# EAGLE design model (EAGLE 9.6.2)
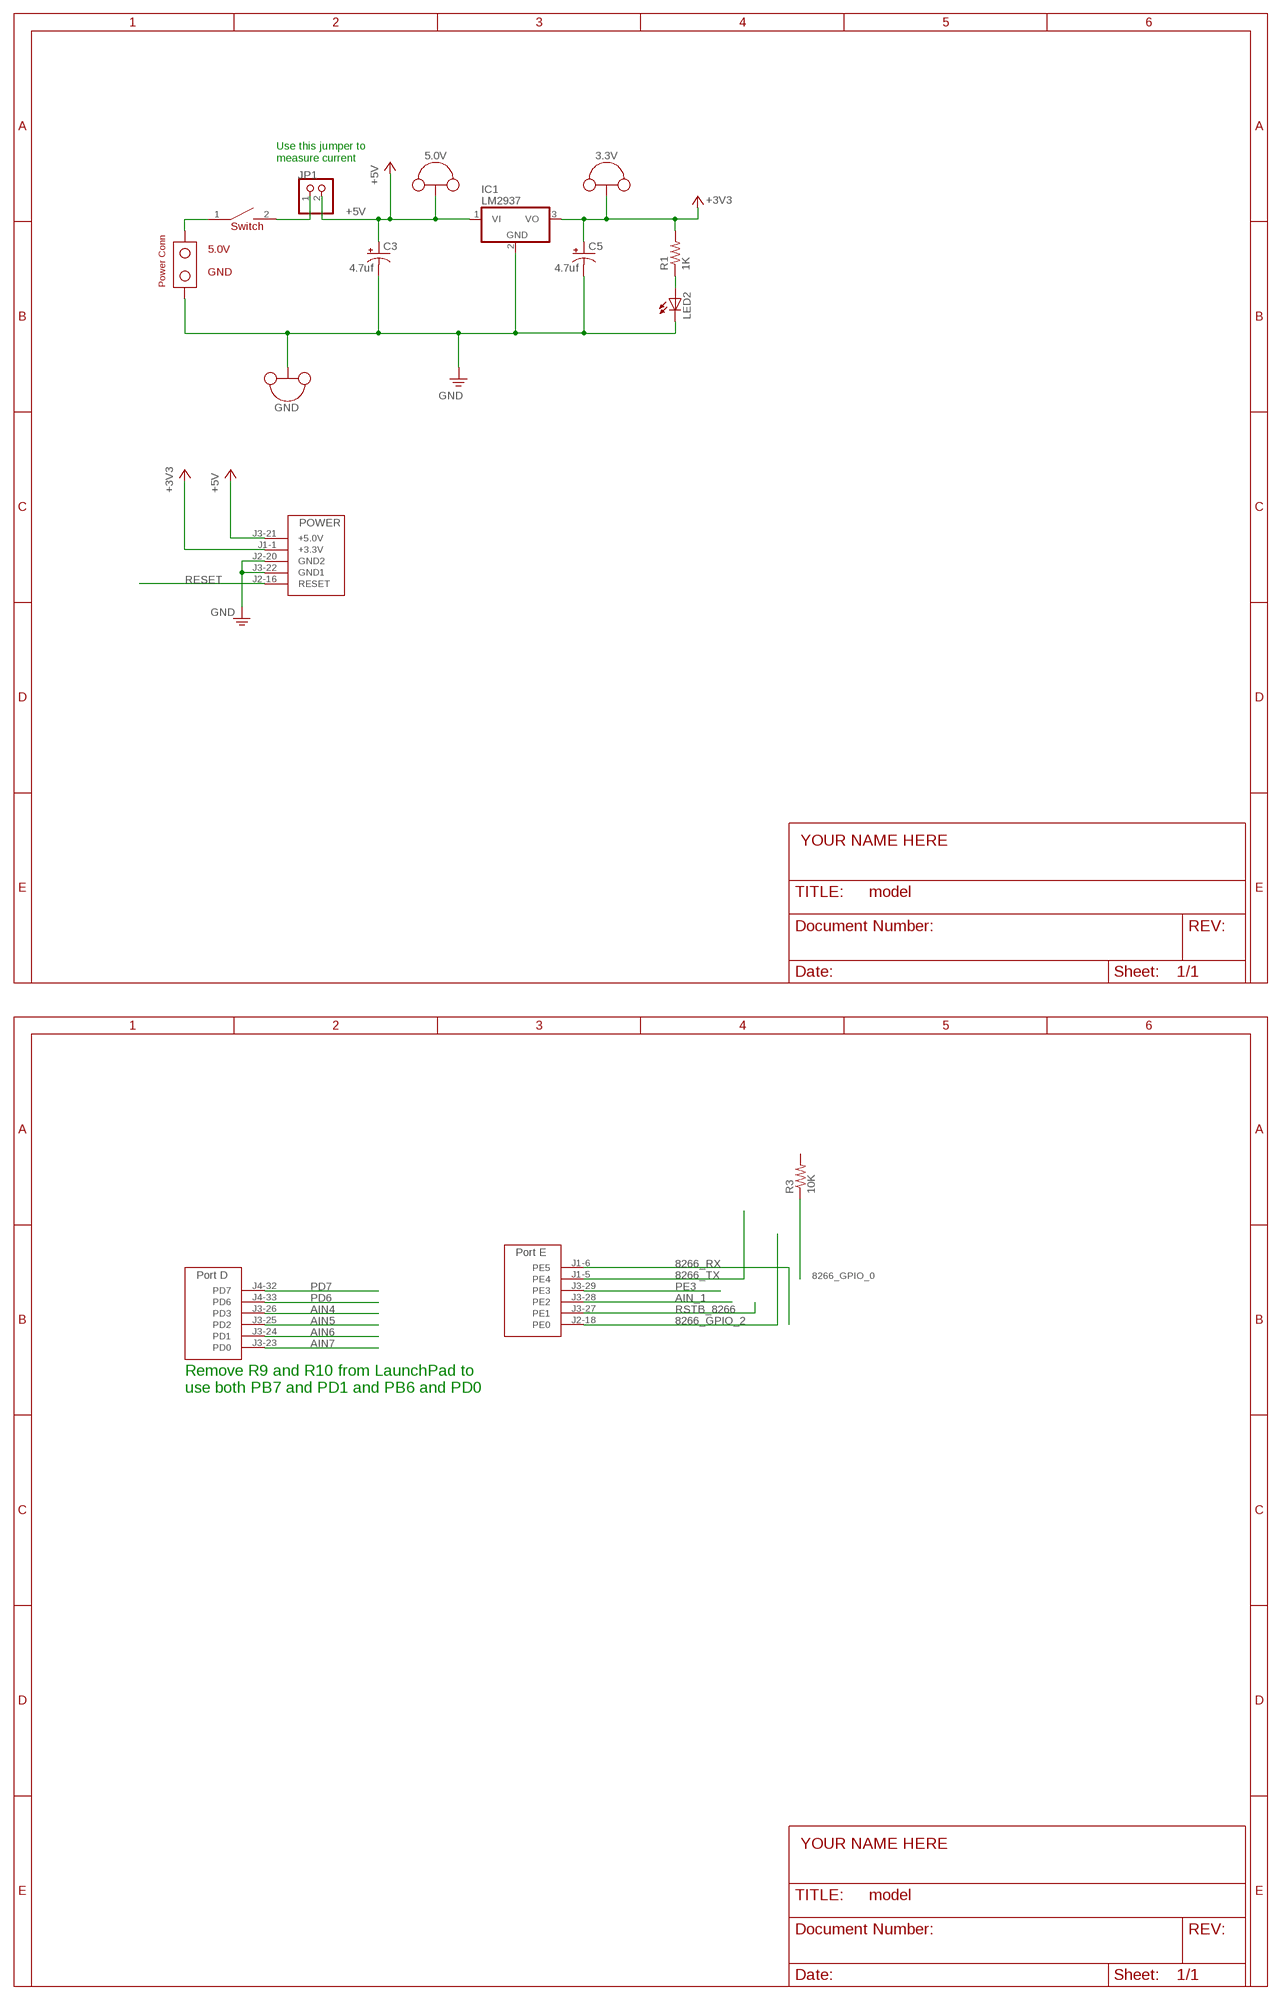
[diagram p0: schematic, sheet 1, part 1 of 2]
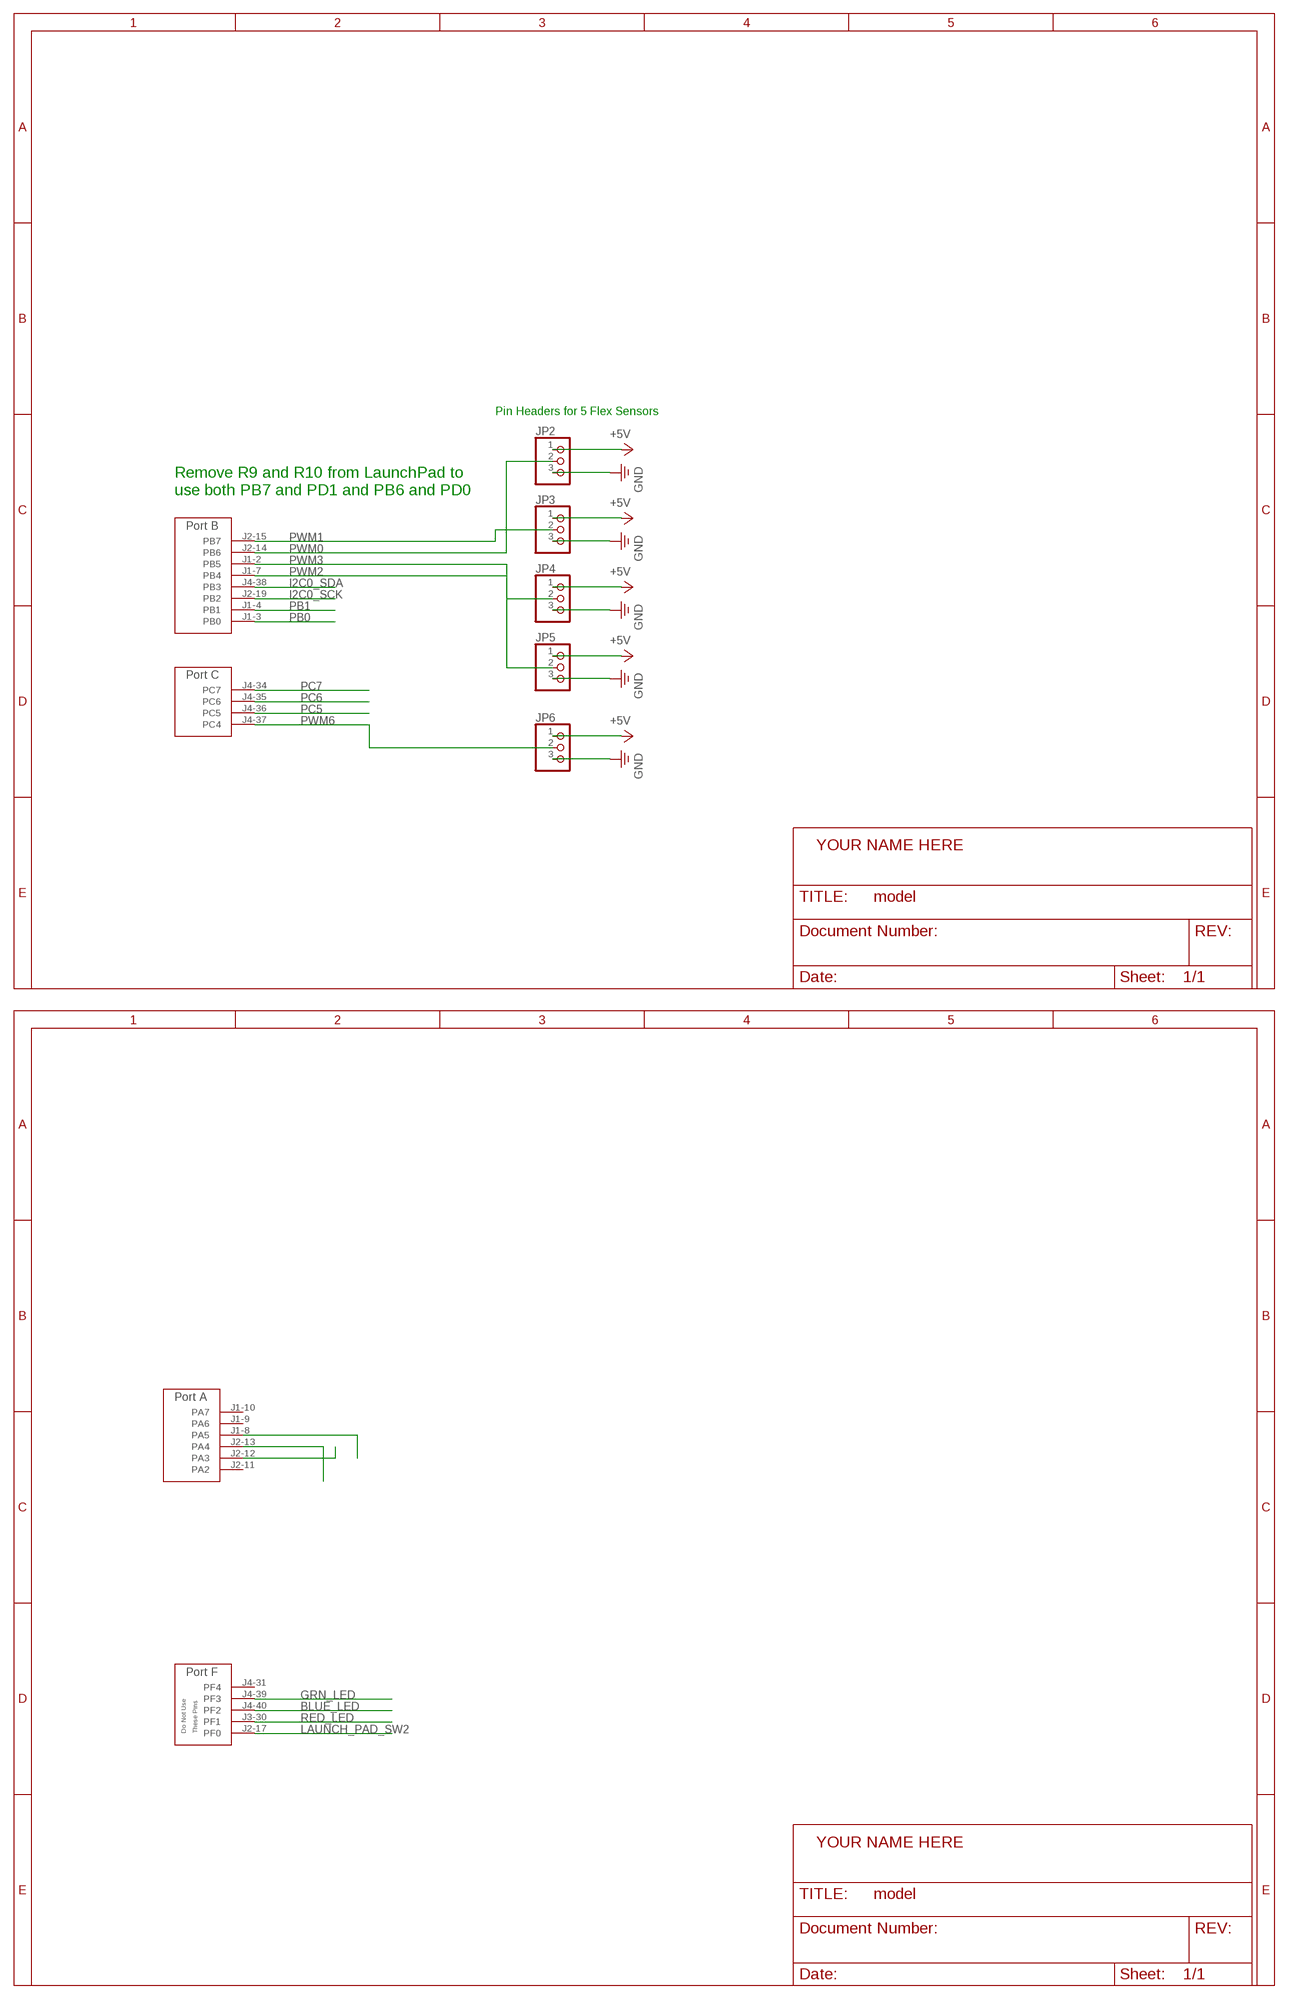
[diagram p1: schematic, sheet 1, part 2 of 2]

## Parts
3.3V  TP_LOOP  [TP_LOOP]
5.0V  TP_LOOP  [TP_LOOP]
C3  4.7uf  CAPACITOR_POLARIZEDE5-6  [CAP200MILPOLARIZED]
C5  4.7uf  CAPACITOR_POLARIZEDE5-6  [CAP200MILPOLARIZED]
GND  TP_LOOP  [TP_LOOP]
IC1  LM2937  [TO220]
JP1  PINHD-1X2  [1X02]
JP2  PINHD-1X3  [1X03]
JP3  PINHD-1X3  [1X03]
JP4  PINHD-1X3  [1X03]
JP5  PINHD-1X3  [1X03]
JP6  PINHD-1X3  [1X03]
LED2  LED3MM  [LED3MM]
R1  1K  RESISTOR0204/5  [RES200MIL]
R3  10K  RESISTOR0204/7  [RES300MIL]
U$2  TM4C_BP  [TM4C_BOOSTER_PACK]
U$5  POWER_CONN  [POWER_CONN]
U$6  SW_POWER_100MIL  [SW_POWER]

## Nets
8266_GPIO_0: R3.1
8266_GPIO_2: U$2.J2-18(PE0)
8266_RX: U$2.J1-6(PE5)
8266_TX: U$2.J1-5(PE4)
+3V3: 3.3V.P$1(TP) 3.3V.P$2(TP) C5.+ IC1.3(VO) R1.2 U$2.J1-1(+3.3V)
+5V: 5.0V.P$1(TP) 5.0V.P$2(TP) C3.+ IC1.1(VI) JP1.2 JP2.1 JP3.1 JP4.1 JP5.1 JP6.1 U$2.J3-21(+5.0V)
AIN4: U$2.J3-26(PD3)
AIN5: U$2.J3-25(PD2)
AIN6: U$2.J3-24(PD1)
AIN7: U$2.J3-23(PD0)
AIN_1: U$2.J3-28(PE2)
BLUE_LED: U$2.J4-40(PF2)
GND: C3.- C5.- GND.P$1(TP) GND.P$2(TP) IC1.2(GND) JP2.3 JP3.3 JP4.3 JP5.3 JP6.3 LED2.K(C) U$2.J2-20(GND2) U$2.J3-22(GND1) U$5.GND
GRN_LED: U$2.J4-39(PF3)
I2C0_SCK: U$2.J2-19(PB2)
I2C0_SDA: U$2.J4-38(PB3)
LAUNCH_PAD_SW2: U$2.J2-17(PF0)
N$3: JP1.1 U$6.2
N$4: LED2.A R1.1
N$5: U$5.VDD U$6.1
PB0: U$2.J1-3(PB0)
PB1: U$2.J1-4(PB1)
PC5: U$2.J4-36(PC5)
PC6: U$2.J4-35(PC6)
PC7: U$2.J4-34(PC7)
PD6: U$2.J4-33(PD6)
PD7: U$2.J4-32(PD7)
PE3: U$2.J3-29(PE3)
PWM0: JP2.2 U$2.J2-14(PB6)
PWM1: JP3.2 U$2.J2-15(PB7)
PWM2: JP4.2 U$2.J1-7(PB4)
PWM3: JP5.2 U$2.J1-2(PB5)
PWM6: JP6.2 U$2.J4-37(PC4)
RED_LED: U$2.J3-30(PF1)
RESET: U$2.J2-16(RESET)
RSTB_8266: U$2.J3-27(PE1)
ST7735_MISO: U$2.J2-13(PA4)
ST7735_MOSI: U$2.J1-8(PA5)
ST7735_TFT_CS: U$2.J2-12(PA3)
Unconnected: R3.2 U$2.J1-9(PA6) U$2.J1-10(PA7) U$2.J2-11(PA2) U$2.J4-31(PF4)

## Notes on the sheet
- Use this jumper to
  measure current
- Pin Headers for 5 Flex Sensors
- Remove R9 and R10 from LaunchPad to
  use both PB7 and PD1 and PB6 and PD0
- YOUR NAME HERE | YOUR NAME HERE
- Remove R9 and R10 from LaunchPad to
  use both PB7 and PD1 and PB6 and PD0
- YOUR NAME HERE
- YOUR NAME HERE

## Library data of the parts
3.3V 5.0V GND = EE445L:TP_LOOP
C3 C5 = EE445L:CAPACITOR_POLARIZED: POLARIZED CAPACITOR, American symbol
IC1 = EE445L:LM2937: LM2937-2.5, LM2937-3.3 400mA and 500mA Voltage Regulators Source: http://cache.national.com/ds/LM/LM2937-2.5.pdf
JP1 = EE445L:PINHD-1X2: PIN HEADER
JP2-JP6 = EE445L:PINHD-1X3: PIN HEADER
LED2 = EE445L:LED: Avago Technologies LED Green 2mA 5mm diffused, HLMP-4740, Digikey 516-1327-ND Red 1.6V 1mA 5mm diffused, HLMP-D150, Digikey 516-1323-ND Yellow 2mA 5mm diffused, HLMP-4719, Digikey 516-1326-ND Orange 10mA 5mm diffused HLMP-D401, Digikey 516-1330-ND Blue 10mA 5mm diffused
R1 R3 = EE445L:RESISTOR: RESISTOR, American symbol
U$2 = EE445L:TM4C_BP
U$5 = EE445L:POWER_CONN
U$6 = EE445L:SW_POWER_100MIL

## Board
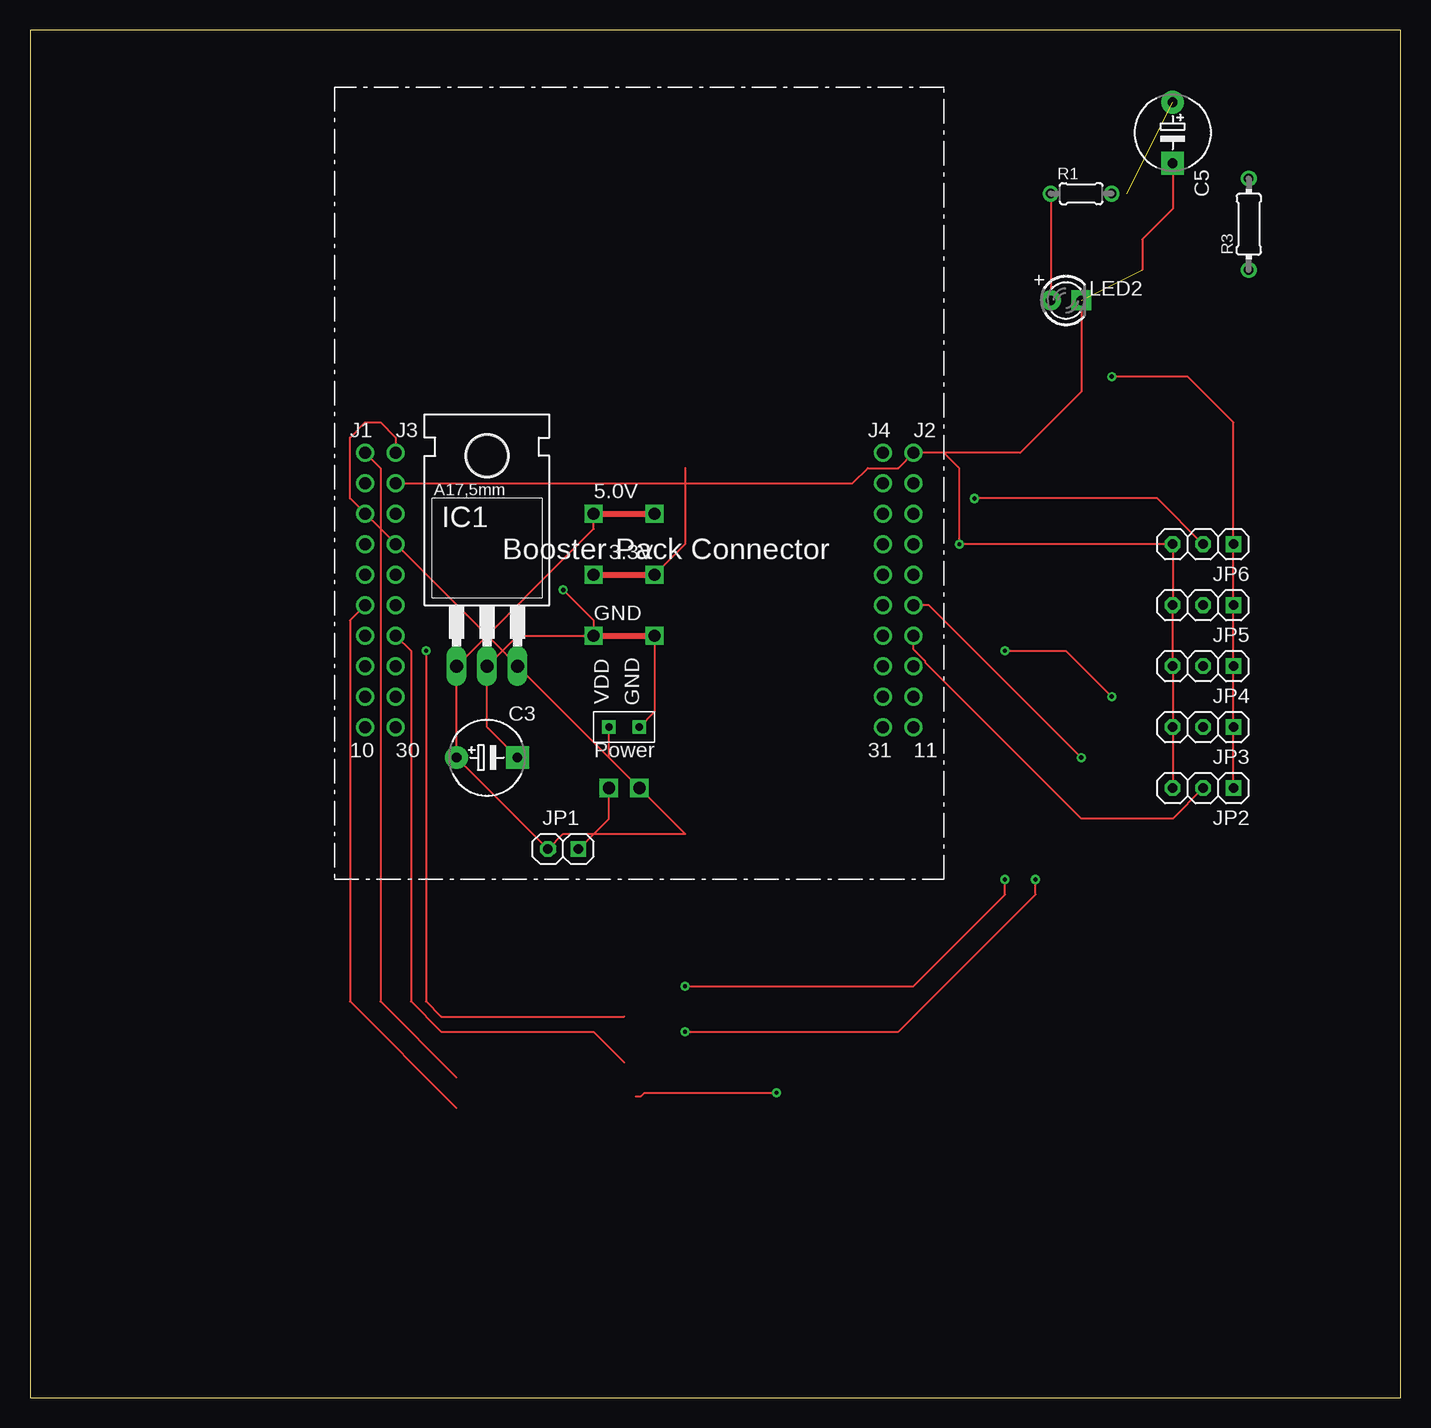
[diagram p2: board, top side]
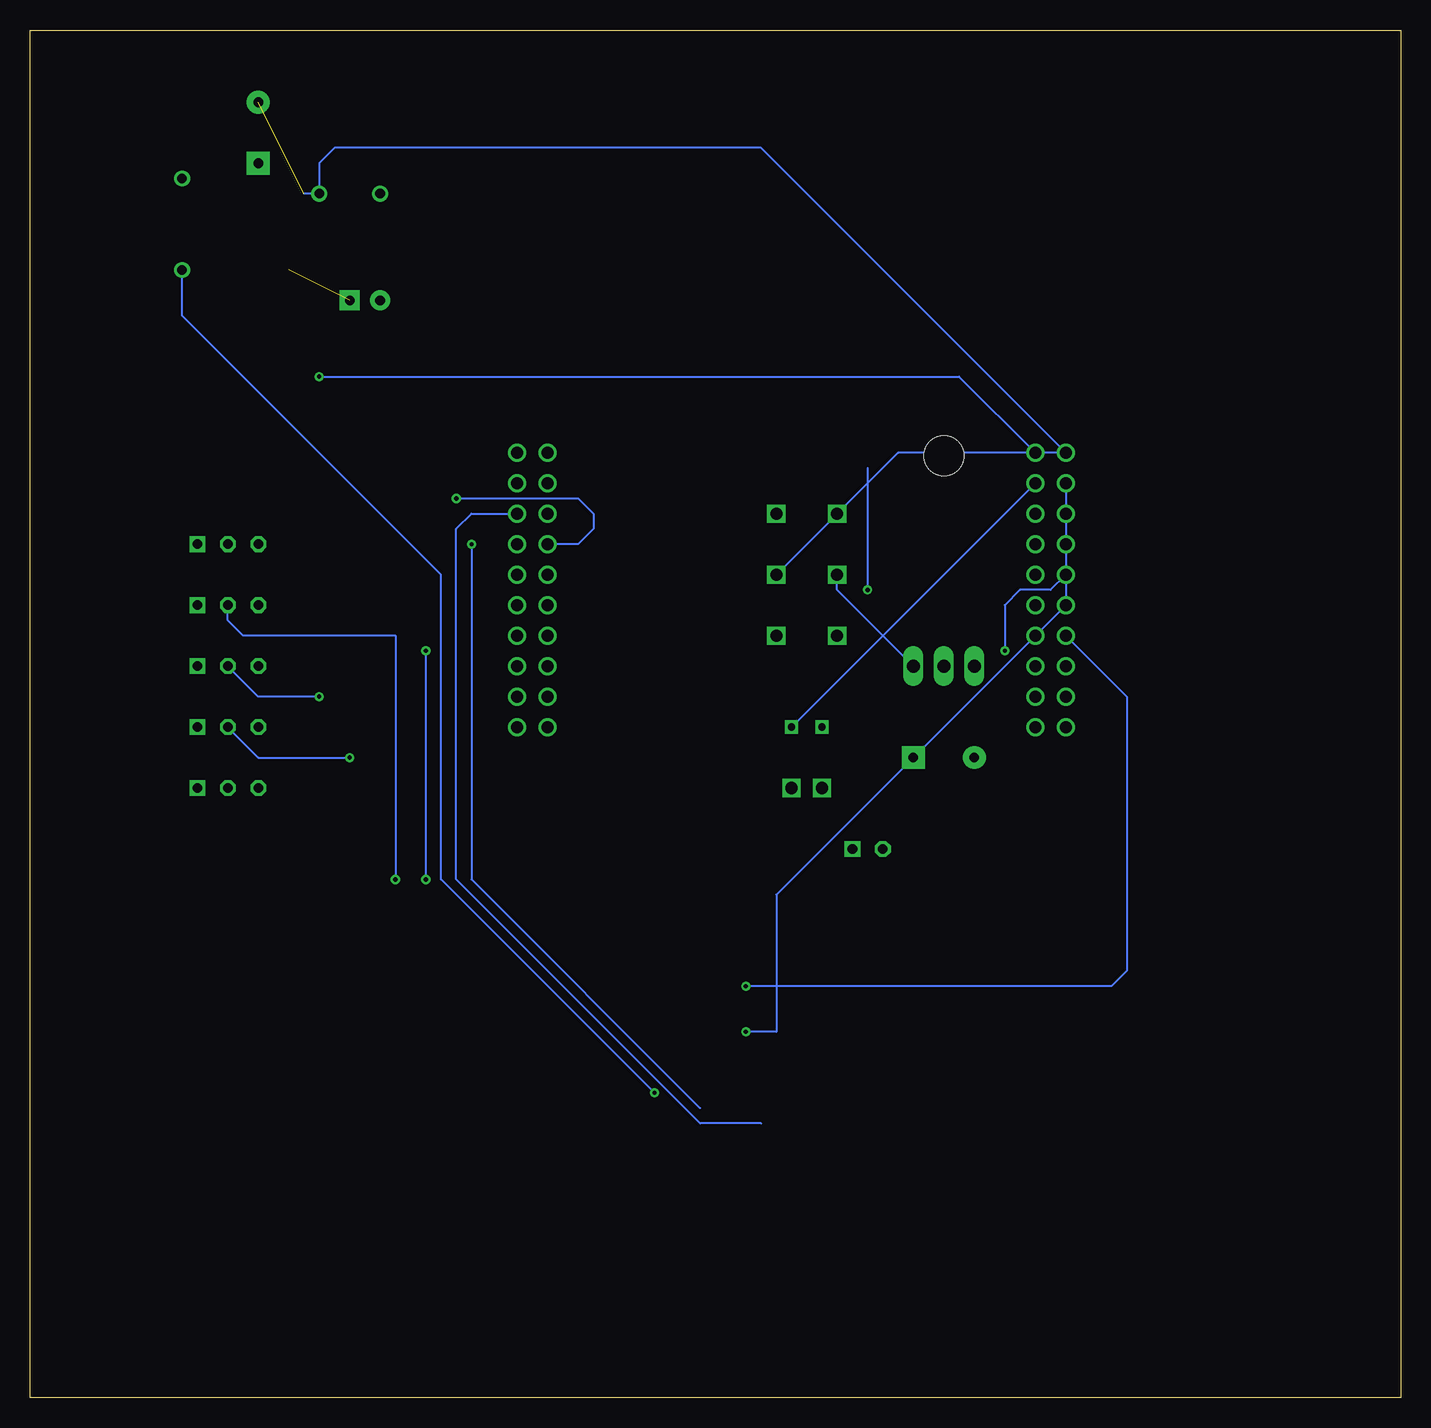
[diagram p3: board, bottom side, seen from below]

Size 114.28 x 113.97 mm. Coordinates in mm from the lower left corner, seen from the top.
Outline: 0,0 114.28,0 114.28,113.97 0,113.97 0,0
Copper layers (1*16): Top 0.035mm / dielectric 1.5mm / Bottom 0.035mm
Design rules "default": minimum track width 6mil, minimum drill 0.35mm, track to track 6mil, track to pad 6mil, pad to pad 6mil, via to via 6mil, smd to smd 6mil, copper to edge 40mil, drill to drill 6mil, minimum pad ring 10mil, minimum via ring 8mil, stop-mask expansion 4mil, vias tented up to drill 0mil, thermal gap 10mil

### Footprints (pad centres in the part's own frame; a part is rotated, then mirrored left to right if it is on the bottom)
TP_LOOP = drill 1 square: P$1 0,0; P$2 5.08,0
CAP200MILPOLARIZED = drill 0.8 pad 1.905: + -2.54,0 | drill 0.8 pad 1.905 square: - 2.54,0
TO220 = drill 1.1 long: 1 -2.54,-6.35; 2 0,-6.35; 3 2.54,-6.35 | hole 3.302: 0,11.176
1X02 = drill 0.8 square: 1 -1.27,0 | drill 0.8 octagon: 2 1.27,0
1X03 = drill 0.8 square: 1 -2.54,0 | drill 0.8 octagon: 2 0,0; 3 2.54,0
LED3MM = drill 0.8 pad 1.676: A -1.27,0 | drill 0.8 pad 1.676 square: K 1.27,0
RES200MIL = drill 0.8: 1 -2.54,0; 2 2.54,0
RES300MIL = drill 0.8: 1 -3.81,0; 2 3.81,0
TM4C_BOOSTER_PACK = drill 1: J1-1 0,22.86; J1-2 0,20.32; J1-3 0,17.78; J1-4 0,15.24; J1-5 0,12.7; J1-6 0,10.16; J1-7 0,7.62; J1-8 0,5.08; J1-9 0,2.54; J1-10 0,0; J2-11 45.72,0; J2-12 45.72,2.54; J2-13 45.72,5.08; J2-14 45.72,7.62; J2-15 45.72,10.16; J2-16 45.72,12.7; J2-17 45.72,15.24; J2-18 45.72,17.78; J2-19 45.72,20.32; J2-20 45.72,22.86; J3-21 2.54,22.86; J3-22 2.54,20.32; J3-23 2.54,17.78; J3-24 2.54,15.24; J3-25 2.54,12.7; J3-26 2.54,10.16; J3-27 2.54,7.62; J3-28 2.54,5.08; J3-29 2.54,2.54; J3-30 2.54,0; J4-31 43.18,0; J4-32 43.18,2.54; J4-33 43.18,5.08; J4-34 43.18,7.62; J4-35 43.18,10.16; J4-36 43.18,12.7; J4-37 43.18,15.24; J4-38 43.18,17.78; J4-39 43.18,20.32; J4-40 43.18,22.86
POWER_CONN = drill 0.6 square: GND 2.54,0; VDD 0,0
SW_POWER = drill 1.016 square: 1 -1.27,0; 2 1.27,0

### Placement (x,y rotation side)
3.3V  46.99,68.58 0 top
5.0V  46.99,73.66 0 top
C3  38.1,53.34 0 top
C5  95.25,105.41 270 top
GND  46.99,63.5 0 top
IC1  38.1,67.31 0 top
JP1  44.45,45.72 180 top
JP2  97.79,50.8 180 top
JP3  97.79,55.88 180 top
JP4  97.79,60.96 180 top
JP5  97.79,66.04 180 top
JP6  97.79,71.12 180 top
LED2  86.36,91.44 0 top
R1  87.63,100.33 0 top
R3  101.6,97.79 90 top
U$2  27.94,55.88 0 top
U$5  48.26,55.88 0 top
U$6  49.53,50.8 180 top

### Tracks (layer width: path | path; a pad name or v marks a point on that pad's centre or on a via)
8266_GPIO_0  (via drill 0.35)
  Top 0.152: 50.49,25.09 50.93,25.09 51.23,25.4 v62.23,25.4
  Bottom 0.152: v62.23,25.4 80.01,43.18 80.01,68.58 101.6,90.17 R3.1
8266_GPIO_2
  Bottom 0.152: 53.34,22.86 58.42,22.86 78.74,43.18 78.74,72.39 77.47,73.66 U$2.J2-18
8266_RX
  Top 0.152: U$2.J1-6 26.67,64.77 26.67,33.02 35.56,24.13
8266_TX  (via drill 0.35)
  Top 0.152: v33.02,62.23 33.02,33.02 34.29,31.75 49.53,31.75
  Bottom 0.152: U$2.J1-5 29.21,67.31 31.75,67.31 33.02,66.04 v33.02,62.23
+3V3  (1 unrouted)
  Top 0.152: 54.61,77.47 54.61,71.12 3.3V.P$2 3.3V.P$1 | U$2.J1-1 29.21,77.47 29.21,33.02 35.56,26.67
  Bottom 0.152: IC1.3 46.99,67.31 3.3V.P$1 | 3.3V.P$2 41.91,78.74 U$2.J1-1 53.34,104.14 88.9,104.14 90.17,102.87 R1.2 91.44,100.33
+5V  (via drill 0.35)
  Top 0.152: 5.0V.P$2 5.0V.P$1 46.99,72.39 IC1.1 C3.+ JP1.2 44.45,46.99 54.61,46.99 26.67,74.93 26.67,80.01 27.94,81.28 29.21,81.28 30.48,80.01 U$2.J3-21 | JP2.1 JP3.1 JP4.1 JP5.1 JP6.1 100.33,81.28 96.52,85.09 v90.17,85.09
  Bottom 0.152: v90.17,85.09 36.83,85.09 U$2.J3-21
GND  (via drill 0.35)  (1 unrouted)
  Top 0.152: C3.- 38.1,55.88 IC1.2 40.64,63.5 GND.P$1 | v44.45,67.31 46.99,64.77 GND.P$1 | U$5.GND 52.07,57.15 GND.P$2 GND.P$1 | C5.- 95.25,99.06 92.71,96.52 92.71,93.98 | LED2.K 87.63,83.82 82.55,78.74 U$2.J2-20 | U$2.J3-22 68.58,76.2 69.85,77.47 72.39,77.47 U$2.J2-20 | U$2.J2-20 76.2,78.74 77.47,77.47 v77.47,71.12 JP6.3 JP5.3 JP4.3 JP3.3 JP2.3
  Bottom 0.152: 44.45,77.47 v44.45,67.31 | U$5.GND U$2.J3-22 | 58.42,24.13 77.47,43.18 v77.47,71.12
N$3
  Top 0.152: JP1.1 48.26,48.26 U$6.2
N$4
  Top 0.152: R1.1 LED2.A
N$5
  Top 0.152: U$6.1 48.26,53.34 U$5.VDD
PWM0
  Top 0.152: JP2.2 95.25,48.26 87.63,48.26 74.64,61.25 74.64,61.37 73.66,62.35 U$2.J2-14
PWM1  (via drill 0.35)
  Top 0.152: v87.63,53.34 74.93,66.04 U$2.J2-15
  Bottom 0.152: JP3.2 95.25,53.34 v87.63,53.34
PWM2  (via drill 0.35)
  Top 0.152: v54.61,34.29 73.66,34.29 81.28,41.91 v81.28,43.18 | v81.28,62.23 86.36,62.23 v90.17,58.42
  Bottom 0.152: U$2.J1-7 22.86,58.42 22.86,35.56 24.13,34.29 v54.61,34.29 | v81.28,43.18 v81.28,62.23 | v90.17,58.42 95.25,58.42 JP4.2
PWM3  (via drill 0.35)
  Top 0.152: v54.61,30.48 72.39,30.48 83.82,41.91 v83.82,43.18
  Bottom 0.152: U$2.J1-2 27.94,66.04 52.07,41.91 52.07,30.48 v54.61,30.48 | v83.82,43.18 83.82,63.5 96.52,63.5 97.79,64.77 JP5.2
PWM6  (via drill 0.35)
  Top 0.152: JP6.2 93.98,74.93 v78.74,74.93
  Bottom 0.152: v78.74,74.93 68.58,74.93 67.31,73.66 67.31,72.39 68.58,71.12 U$2.J4-37
RSTB_8266
  Top 0.152: U$2.J3-27 31.75,62.23 31.75,33.02 34.29,30.48 46.99,30.48 49.53,27.94